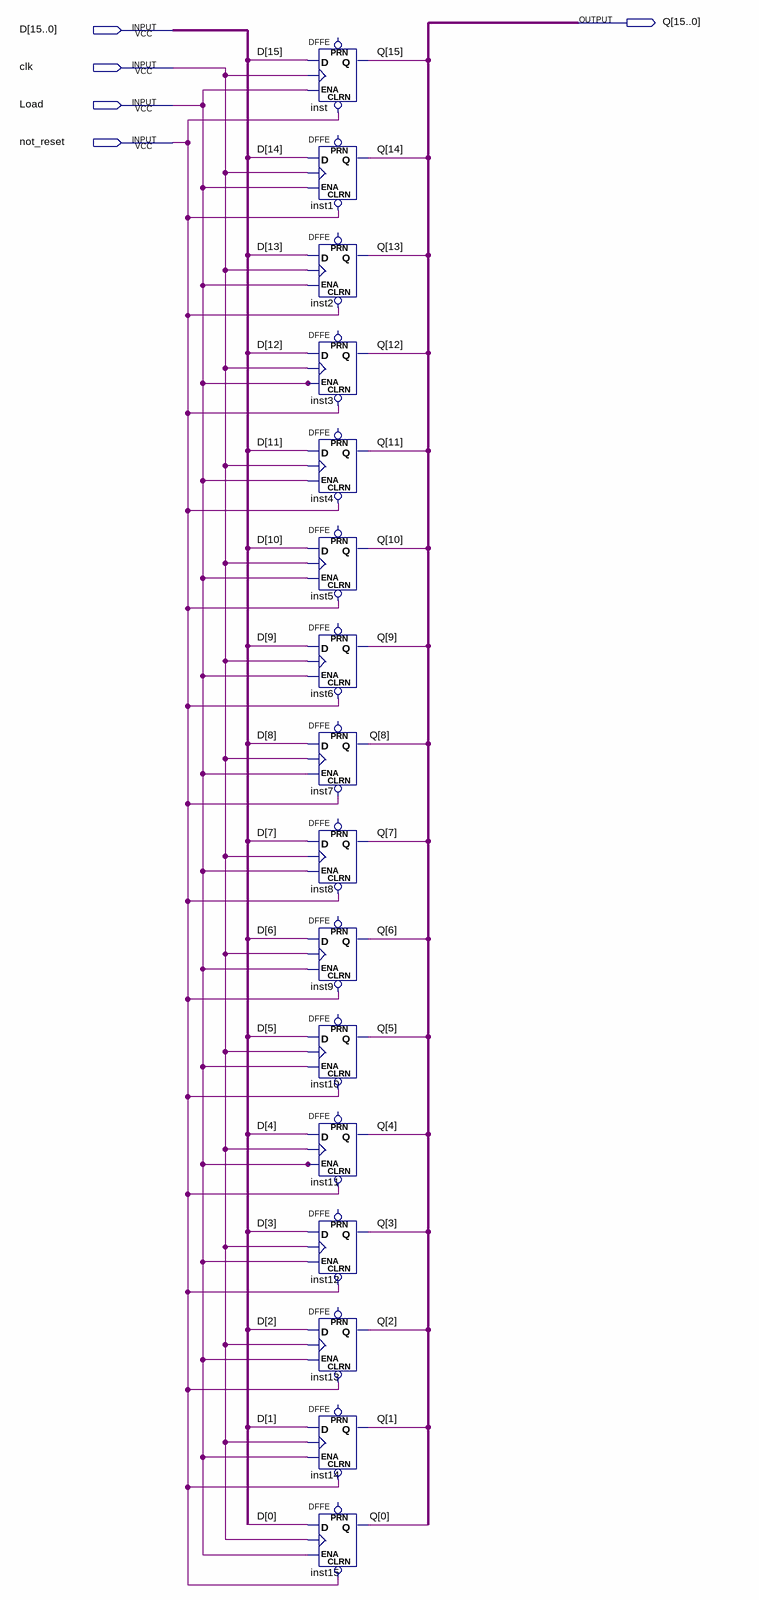
[diagram p0: schematic sheet]
// Quartus schematic reg_16bit.bdf as structural Verilog: 16 symbols, 5 pins
module reg_16bit (
  input  [15:0] D,
  input  clk,
  input  Load,
  input  not_reset,
  output [15:0] Q
);

  DFFE inst (.CLRN(not_reset), .D(D[15]), .CLK(clk), .ENA(Load), .Q(Q[15]));  // open: PRN
  DFFE inst1 (.CLRN(not_reset), .D(D[14]), .CLK(clk), .ENA(Load), .Q(Q[14]));  // open: PRN
  DFFE inst2 (.CLRN(not_reset), .D(D[13]), .CLK(clk), .ENA(Load), .Q(Q[13]));  // open: PRN
  DFFE inst3 (.CLRN(not_reset), .D(D[12]), .CLK(clk), .ENA(Load), .Q(Q[12]));  // open: PRN
  DFFE inst4 (.CLRN(not_reset), .D(D[11]), .CLK(clk), .ENA(Load), .Q(Q[11]));  // open: PRN
  DFFE inst5 (.CLRN(not_reset), .D(D[10]), .CLK(clk), .ENA(Load), .Q(Q[10]));  // open: PRN
  DFFE inst6 (.CLRN(not_reset), .D(D[9]), .CLK(clk), .ENA(Load), .Q(Q[9]));  // open: PRN
  DFFE inst7 (.CLRN(not_reset), .D(D[8]), .CLK(clk), .ENA(Load), .Q(Q[8]));  // open: PRN
  DFFE inst8 (.CLRN(not_reset), .D(D[7]), .CLK(clk), .ENA(Load), .Q(Q[7]));  // open: PRN
  DFFE inst9 (.CLRN(not_reset), .D(D[6]), .CLK(clk), .ENA(Load), .Q(Q[6]));  // open: PRN
  DFFE inst10 (.CLRN(not_reset), .D(D[5]), .CLK(clk), .ENA(Load), .Q(Q[5]));  // open: PRN
  DFFE inst11 (.CLRN(not_reset), .D(D[4]), .CLK(clk), .ENA(Load), .Q(Q[4]));  // open: PRN
  DFFE inst12 (.CLRN(not_reset), .D(D[3]), .CLK(clk), .ENA(Load), .Q(Q[3]));  // open: PRN
  DFFE inst13 (.CLRN(not_reset), .D(D[2]), .CLK(clk), .ENA(Load), .Q(Q[2]));  // open: PRN
  DFFE inst14 (.CLRN(not_reset), .D(D[1]), .CLK(clk), .ENA(Load), .Q(Q[1]));  // open: PRN
  DFFE inst15 (.CLRN(not_reset), .D(D[0]), .CLK(clk), .ENA(Load), .Q(Q[0]));  // open: PRN
endmodule
